# EAGLE design sensorAA (EAGLE 6.4)
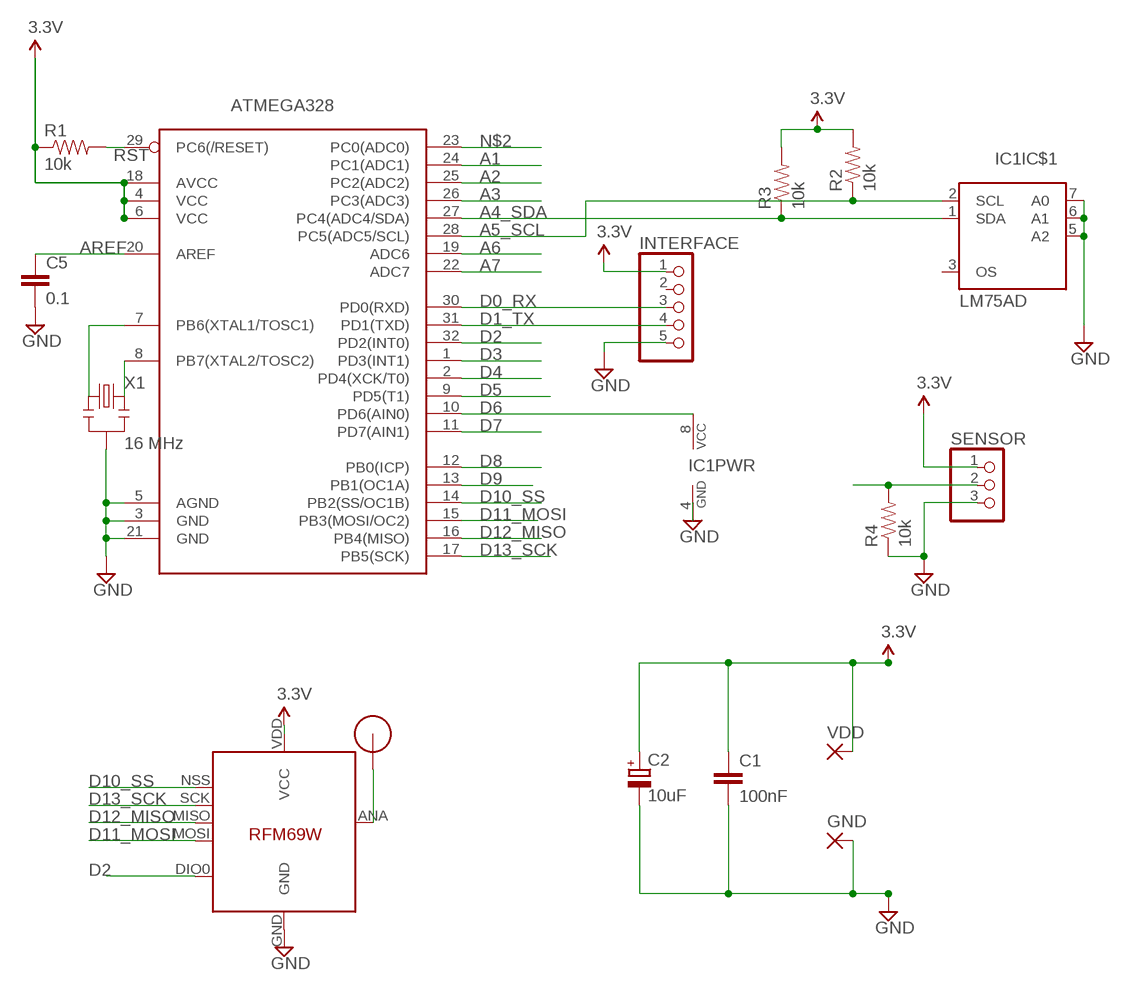
[diagram p0: schematic, sheet 1]

## Parts
ATMEGA328  ATMega-328  ATMEGA168/328TQFP32  [TQFP32-08]
C1  100nF  C-EUC2012  [C2012]
C2  10uF  CPOL-EUSMCA  [SMC_A]
C5  0.1  CAP0603-CAP  [0603-CAP]
GND  SMD5  [SMD2,54-5,08]
IC1  LM75AD  [SO08]
IC4  RFM69  [RFM69W-MINPADS]
INTERFACE  PINHD-1X5  [1X05]
R1  10k  RESISTOR0603-RES  [0603-RES]
R2  10k  RESISTOR0603-RES  [0603-RES]
R3  10k  RESISTOR0603-RES  [0603-RES]
R4  10k  RESISTOR0603-RES  [0603-RES]
SENSOR  PINHD-1X3  [1X03]
U$1  RFM12B_ANTENNA  [RFM12B-ANTENNA]
VDD  SMD5  [SMD2,54-5,08]
X1  16 MHz  RESONATORSMD  [RESONATOR-SMD]

## Nets
A1: ATMEGA328.24(PC1(ADC1))
A2: ATMEGA328.25(PC2(ADC2))
A3: ATMEGA328.26(PC3(ADC3))
A4_SDA: ATMEGA328.27(PC4(ADC4/SDA)) IC1.1(IC$1:SDA) R3.1
A5_SCL: ATMEGA328.28(PC5(ADC5/SCL)) IC1.2(IC$1:SCL) R2.1
A6: ATMEGA328.19(ADC6)
A7: ATMEGA328.22(ADC7)
AREF: ATMEGA328.20(AREF) C5.1
D0_RX: ATMEGA328.30(PD0(RXD)) INTERFACE.3
D1_TX: ATMEGA328.31(PD1(TXD)) INTERFACE.4
D2: ATMEGA328.32(PD2(INT0)) IC4.DIO0
D3: ATMEGA328.1(PD3(INT1)) R4.2 SENSOR.2
D4: ATMEGA328.2(PD4(XCK/T0))
D5: ATMEGA328.9(PD5(T1))
D6: ATMEGA328.10(PD6(AIN0)) IC1.8(PWR:VCC)
D7: ATMEGA328.11(PD7(AIN1))
D8: ATMEGA328.12(PB0(ICP))
D9: ATMEGA328.13(PB1(OC1A))
D10_SS: ATMEGA328.14(PB2(SS/OC1B)) IC4.NSS(SEL)
D11_MOSI: ATMEGA328.15(PB3(MOSI/OC2)) IC4.MOSI
D12_MISO: ATMEGA328.16(PB4(MISO)) IC4.MISO
D13_SCK: ATMEGA328.17(PB5(SCK)) IC4.SCK
GND: ATMEGA328.3(GND) ATMEGA328.5(AGND) ATMEGA328.21(GND) C1.2 C2.- C5.2 GND.1(P) IC1.4(PWR:GND) IC1.5(IC$1:A2) IC1.6(IC$1:A1) IC1.7(IC$1:A0) IC4.GND INTERFACE.5 R4.1 SENSOR.3 X1.2
N$1: ATMEGA328.7(PB6(XTAL1/TOSC1)) X1.1
N$2: ATMEGA328.23(PC0(ADC0))
N$3: IC4.ANA(ANT) U$1.P$1
N$21: ATMEGA328.8(PB7(XTAL2/TOSC2)) X1.3
RST: ATMEGA328.29(PC6(/RESET)) R1.2
VCC: ATMEGA328.4(VCC) ATMEGA328.6(VCC) ATMEGA328.18(AVCC) C1.1 C2.+ IC4.VDD(VCC) INTERFACE.1 R1.1 R2.2 R3.2 SENSOR.1 VDD.1(P) ; supply symbol labelled 3.3V
Unconnected: IC1.3(IC$1:OS) INTERFACE.2

## Library data of the parts
ATMEGA328 = LowPowerLab:ATMEGA168/328: Atmel 32-pin 8-bit micro, 16k flash.
C1 = resistor:C-EU: CAPACITOR, European symbol
C2 = resistor:CPOL-EU: POLARIZED CAPACITOR, European symbol
C5 = LowPowerLab:CAP: Capacitor Standard 0603 ceramic capacitor, and 0.1" leaded capacitor.
GND VDD = wirepad:SMD5: SMD PAD
IC1 = i2c:LM75AD: Digital Temperature Sensor and Thermal Watchdog
IC4 = LowPowerLab:RFM69
INTERFACE = pinhead:PINHD-1X5: PIN HEADER
R1-R4 = LowPowerLab:RESISTOR: Resistor Basic schematic elements and footprints for 0603, 1206, and PTH resistors.
SENSOR = pinhead:PINHD-1X3: PIN HEADER
U$1 = LowPowerLab:RFM12B_ANTENNA
X1 = SparkFun:RESONATOR: Resonator Small SMD resonator. This is the itty bitty 10/20MHz resonators with built in caps. CSTCE10M0G55 and CSTCE20M0V53. Footprint has been reviewed closely but hasn't been tested yet.

## Net classes
1 power: width 0.381 mm, clearance 0.254 mm

## Board
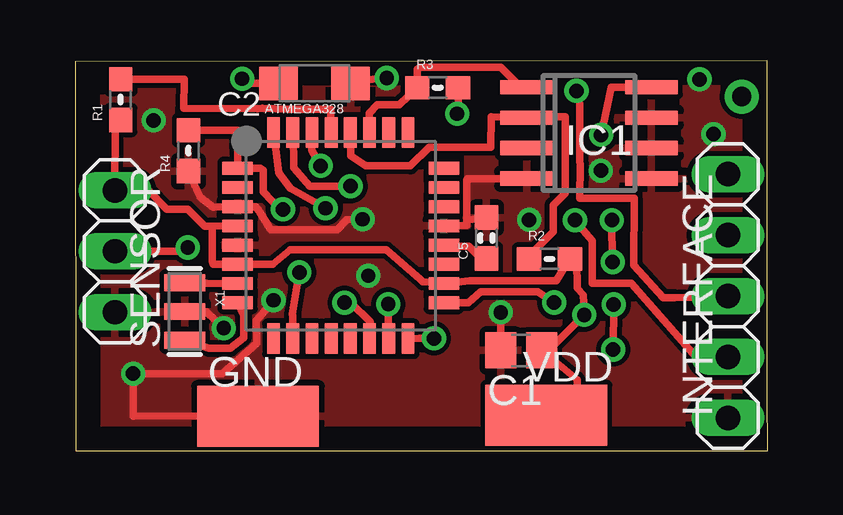
[diagram p1: board, top side]
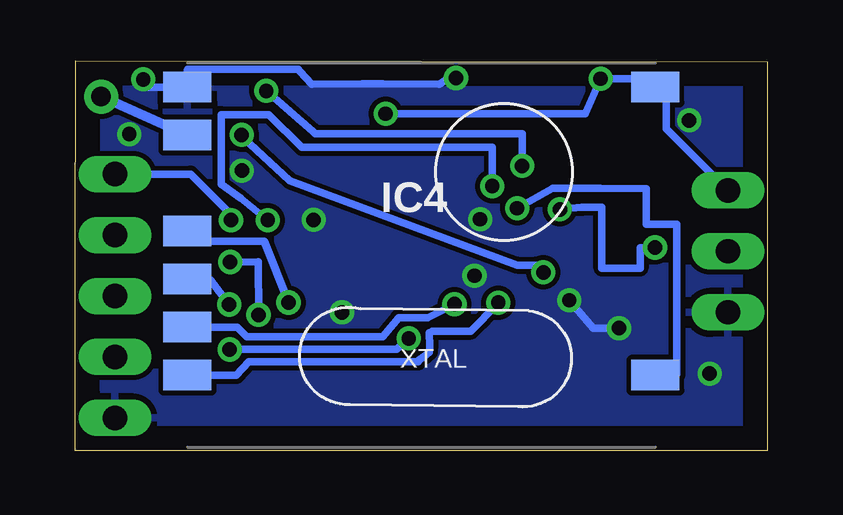
[diagram p2: board, bottom side, seen from below]

Size 28.85 x 16.23 mm. Coordinates in mm from the lower left corner, seen from the top.
Outline: 0.01,0 28.85,0 28.84,2.34 28.84,7.76 28.83,16.23 0,16.2 0.01,0
Copper layers (1*16): Top 0.035mm / dielectric 1.5mm / Bottom 0.035mm
Design rules "default": minimum track width 10mil, minimum drill 24mil, track to track 8mil, track to pad 8mil, pad to pad 8mil, via to via 8mil, smd to smd 8mil, copper to edge 40mil, drill to drill 8mil, minimum pad ring 10mil, minimum via ring 8mil, stop-mask expansion 4mil, vias tented up to drill 0mil, thermal gap 10mil

### Footprints (pad centres in the part's own frame; a part is rotated, then mirrored left to right if it is on the bottom)
TQFP32-08 = smd 1.27 x 0.533: 1 -4.293,2.8; 2 -4.293,2; 3 -4.293,1.2; 4 -4.293,0.4; 5 -4.293,-0.4; 6 -4.293,-1.2; 7 -4.293,-2; 8 -4.293,-2.8; 17 4.293,-2.8; 18 4.293,-2; 19 4.293,-1.2; 20 4.293,-0.4; 21 4.293,0.4; 22 4.293,1.2; 23 4.293,2; 24 4.293,2.8 | smd 0.533 x 1.27: 9 -2.8,-4.293; 10 -2,-4.293; 11 -1.2,-4.293; 12 -0.4,-4.293; 13 0.4,-4.293; 14 1.2,-4.293; 15 2,-4.293; 16 2.8,-4.293; 25 2.8,4.293; 26 2,4.293; 27 1.2,4.293; 28 0.4,4.293; 29 -0.4,4.293; 30 -1.2,4.293; 31 -2,4.293; 32 -2.8,4.293
C2012 = smd 1.3 x 1.5: 1 -0.85,0; 2 0.85,0
SMC_A = smd 1.6 x 1.4: + -1.5,0; - 1.5,0
0603-CAP = smd 1.016 x 0.965: 1 -0.85,0; 2 0.85,0
SMD2,54-5,08 = smd 2.54 x 5.08: 1 0,0
SO08 = smd 0.6 x 2.2: 1 -1.905,-2.6; 2 -0.635,-2.6; 3 0.635,-2.6; 4 1.905,-2.6; 5 1.905,2.6; 6 0.635,2.6; 7 -0.635,2.6; 8 -1.905,2.6
RFM69W-MINPADS = smd 2 x 1.27: ANA 8,-5; DIO0 -11.5,5; GND 8,-7; MISO 8,1; MOSI 8,3; NSS 8,5; SCK 8,-1; VDD -11.5,-7
1X05 = drill 1.016 long: 1 -5.08,0; 2 -2.54,0; 3 0,0; 4 2.54,0; 5 5.08,0
0603-RES = smd 1.016 x 0.965: 1 -0.85,0; 2 0.85,0
1X03 = drill 1.016 long: 1 -2.54,0; 2 0,0; 3 2.54,0
RFM12B-ANTENNA = drill 0.8 pad 1.422: P$1 0,0
RESONATOR-SMD = smd 0.7 x 1.7: 1 -1.2,0; 2 0,0; 3 1.2,0

### Placement (x,y rotation side)
ATMEGA328  11.06,8.96 0 top
C1  18.58,4.18 180 top
C2  9.97,15.3 0 top
C5  17.13,8.86 90 top
GND  7.61,1.42 90 top
IC1  21.4,13.24 270 top
IC4  16.17,8.15 180 bottom
INTERFACE  27.19,6.44 270 top
R1  1.89,14.62 90 top
R2  19.75,7.99 0 top
R3  15.1,15.12 0 top
R4  4.71,12.5 90 top
SENSOR  1.65,8.31 270 top
U$1  27.76,14.75 0 top
VDD  19.62,1.47 90 top
X1  4.56,5.79 270 top

### Tracks (layer width: path | path; a pad name or v marks a point on that pad's centre or on a via)
A4_SDA
  Top 0.305: 12.21,13.73 12.24,13.28 | 12.24,13.28 ATMEGA328.27 | 12.24,13.28 12.24,14.06 12.58,14.4 13.5,14.4 R3.1 14.25,15.15 14.25,15.88 14.34,15.97 17.73,15.97 18.52,15.18 IC1.1
A5_SCL
  Top 0.305: ATMEGA328.28 11.47,13.24 11.47,12.28 12.11,11.87 13.96,11.87 14.74,12.65 17.31,12.65 17.33,13.9 IC1.2 18.81,13.91 20.4,13.91 20.4,10.73 19.91,10.23 19.91,9.11 18.89,8.09 R2.1
AREF
  Top 0.305: ATMEGA328.20 15.4,8.51 16.39,8.51 16.99,7.91 C5.1
D0_RX  (via drill 0.6)
  Top 0.305: ATMEGA328.30 9.86,12.51 v10.22,11.87 | v20.88,14.99 20.99,14.8 21.02,14.21 21.02,12.04 21.03,11.94 21.02,10.51 23.28,10.51 23.27,7.72 24.49,6.37 | 24.96,6.37 24.49,6.37 | 24.49,6.37 27.14,6.39 INTERFACE.3
  Bottom 0.305: v10.22,11.87 10.21,12.59 10.22,13.2 18.83,13.2 18.93,13.29 v20.88,14.99
D1_TX  (via drill 0.6)
  Top 0.305: v11.47,11.02 9.77,11.03 9.09,11.78 9.07,13.24 ATMEGA328.31 | v20.82,9.6 21.53,8.74 21.55,6.97 23.16,6.97 25.87,3.89 27.18,3.89 INTERFACE.4
  Bottom 0.305: v11.47,11.02 11.47,12.63 19.4,12.63 20.77,14 22.76,14 22.76,11.1 21.95,10.52 v20.82,9.6
D2  (via drill 0.6)
  Top 0.305: ATMEGA328.32 8.46,11.58 8.47,11.57 8.96,10.94 v10.42,10.1
  Bottom 0.305: v10.42,10.1 8.93,10.94 6.98,10.93 6.97,10.93 5.04,10.92 5.04,9.43 3.78,9.43 3.77,4.54 3.77,3.17 4.69,3.17 IC4.DIO0
D3  (via drill 0.6)
  Top 0.305: R4.2 6.76,13.35 ATMEGA328.1 7.71,11.77 7.83,11.68 7.83,10.79 8.58,9.99 v8.65,10.05 | SENSOR.2 4.56,8.3 v4.68,8.46
  Bottom 0.305: v8.65,10.05 7.73,10.14 6.9,10.13 6.9,7.6 5.3,7.6 5.3,8.46 v4.68,8.46
D6  (via drill 0.6)
  Top 0.305: IC1.8 22.32,15.14 v21.91,13.16 | v9.33,7.43 9.04,5.69 9.06,5.64 ATMEGA328.10
  Bottom 0.305: v21.91,13.16 21.84,13.03 19.91,11.25 10.43,7.73 9.64,7.73 v9.33,7.43
D10_SS  (via drill 0.6)
  Top 0.305: v11.21,6.17 11.48,6.17 12.28,5.37 12.3,4.71 ATMEGA328.14
  Bottom 0.305: IC4.NSS 22.13,3.13 21.62,3.69 14.55,3.7 14.52,3.76 14.23,3.97 14.08,4.11 14.06,4.34 14.08,4.91 13.97,4.98 12.35,4.98 11.98,5.35 v11.21,6.17
D11_MOSI  (via drill 0.6)
  Top 0.305: v13.04,6.1 13.04,4.69 ATMEGA328.15
  Bottom 0.305: IC4.MOSI 22.09,5.15 21.69,4.75 16.02,4.75 15.37,5.54 14.15,5.54 v13.04,6.1
D12_MISO  (via drill 0.6)
  Top 0.305: v22.43,6.09 v22.4,4.21 | v14.94,4.67 14.34,4.67 ATMEGA328.16
  Bottom 0.305: IC4.MISO 23.22,7.11 v22.43,6.09 | v22.4,4.21 15.43,4.21 v14.94,4.67
D13_SCK  (via drill 0.6)
  Top 0.305: v19.95,6.17 19.27,6.62 16.89,6.62 16.38,6.17 ATMEGA328.17
  Bottom 0.305: IC4.SCK 23.41,9.15 23.41,8.71 20.96,8.73 v19.95,6.17
GND  (via drill 0.6)
  Top 0.305: IC1.4 18.41,11.33 16.34,11.33 16.31,11.28 16.31,9.54 | 16.31,9.54 16.31,9.39 ATMEGA328.21 | GND.1 6.21,1.44 2.4,1.43 v2.4,3.21 6.13,3.2 7.55,4.48 7.53,5.4 v8.26,6.26 | IC1.5 23.35,11.33 23.33,11.35 | C2.- 11.62,15.38 v12.97,15.53 | v11.97,9.64 11.3,9.62 10.92,9.21 10.26,9.2 8.88,9.2 8.13,9.21 7.67,9.97 7.51,10.16 ATMEGA328.3 5.75,10.13 5.21,10.56 R4.1 | C5.2 16.37,9.61 16.31,9.54 | C1.2 v17.73,5.77 17.74,5.78 | X1.2 5.45,5.79 v6.18,5.1
  Bottom 0.305: v26.01,15.47 25.8,15.15 IC4.GND 24.17,15.85 24.16,15.89 19.55,15.89 19.48,15.82 18.99,15.28 16.87,15.28 16.02,15.28 13.68,15.27 13.26,15.53 13,15.53 v12.97,15.53 | v6.18,5.1 7.26,5.1 v8.26,6.26
  other vias: 18.91,9.61 12.2,7.29 21.9,11.66 26.59,13.19 3.26,13.76
  pour Top: 0.17,16.05 28.67,16.05 28.67,0.22 0.17,0.22 0.17,15.81 0.17,16.02
  pour Bottom: 0.17,16.07 28.65,16.07 28.65,0.2 0.17,0.17
N$1
  Top 0.305: X1.1 4.97,6.99 5.46,6.97 6.76,6.95 ATMEGA328.7
N$3
  Bottom 0.406: IC4.ANA U$1.P$1
N$21
  Top 0.305: X1.3 5.56,4.26 6.46,4.26 7.01,4.71 7.01,5.62 6.76,6.15 ATMEGA328.8
RST
  Top 0.305: R1.2 4.53,15.46 4.51,14.26 7.6,14.25 7.78,14.26 8.86,14.22 10.64,14.22 10.64,13.28 ATMEGA328.29
VCC  (via drill 0.6)
  Top 0.305: VDD.1 20.87,1.38 20.9,2.08 | 20.07,2.08 20.9,2.08 | ATMEGA328.4 5.72,9.35 | 5.72,9.35 5.7,9.21 5.7,7.91 5.75,7.77 ATMEGA328.6 8.23,7.76 8.96,8.37 12.96,8.37 14.37,7.14 14.47,7.03 15.31,7 ATMEGA328.18 16.42,7.07 20.04,7.07 R2.2 20.65,7.93 20.9,7.88 20.92,6.79 21.16,6.47 21.18,6.17 21.18,5.64 v21.2,5.66 19.96,4.42 C1.1 20.9,2.94 20.9,2.08 | v22.35,9.6 22.37,7.86 v22.39,7.86 | C2.+ 7.05,15.3 v6.95,15.49 | R3.2 15.95,14.08 v15.91,14.04 | R1.1 1.65,13.58 SENSOR.1 3.03,10.84 3.81,10.07 4.68,10.07 5.39,9.35 5.72,9.35
  Bottom 0.305: INTERFACE.1 24.03,11.52 22.39,9.88 22.39,9.5 v22.35,9.6 | v22.39,7.86 21.2,7.88 v21.2,5.66 | v15.91,14.04 7.59,14.04 v6.95,15.49 6.45,15.49 4.74,15.5 4.96,15.09 IC4.VDD 4.66,15.15 4.62,15.18 4.21,14.9 4.21,13.41 SENSOR.1